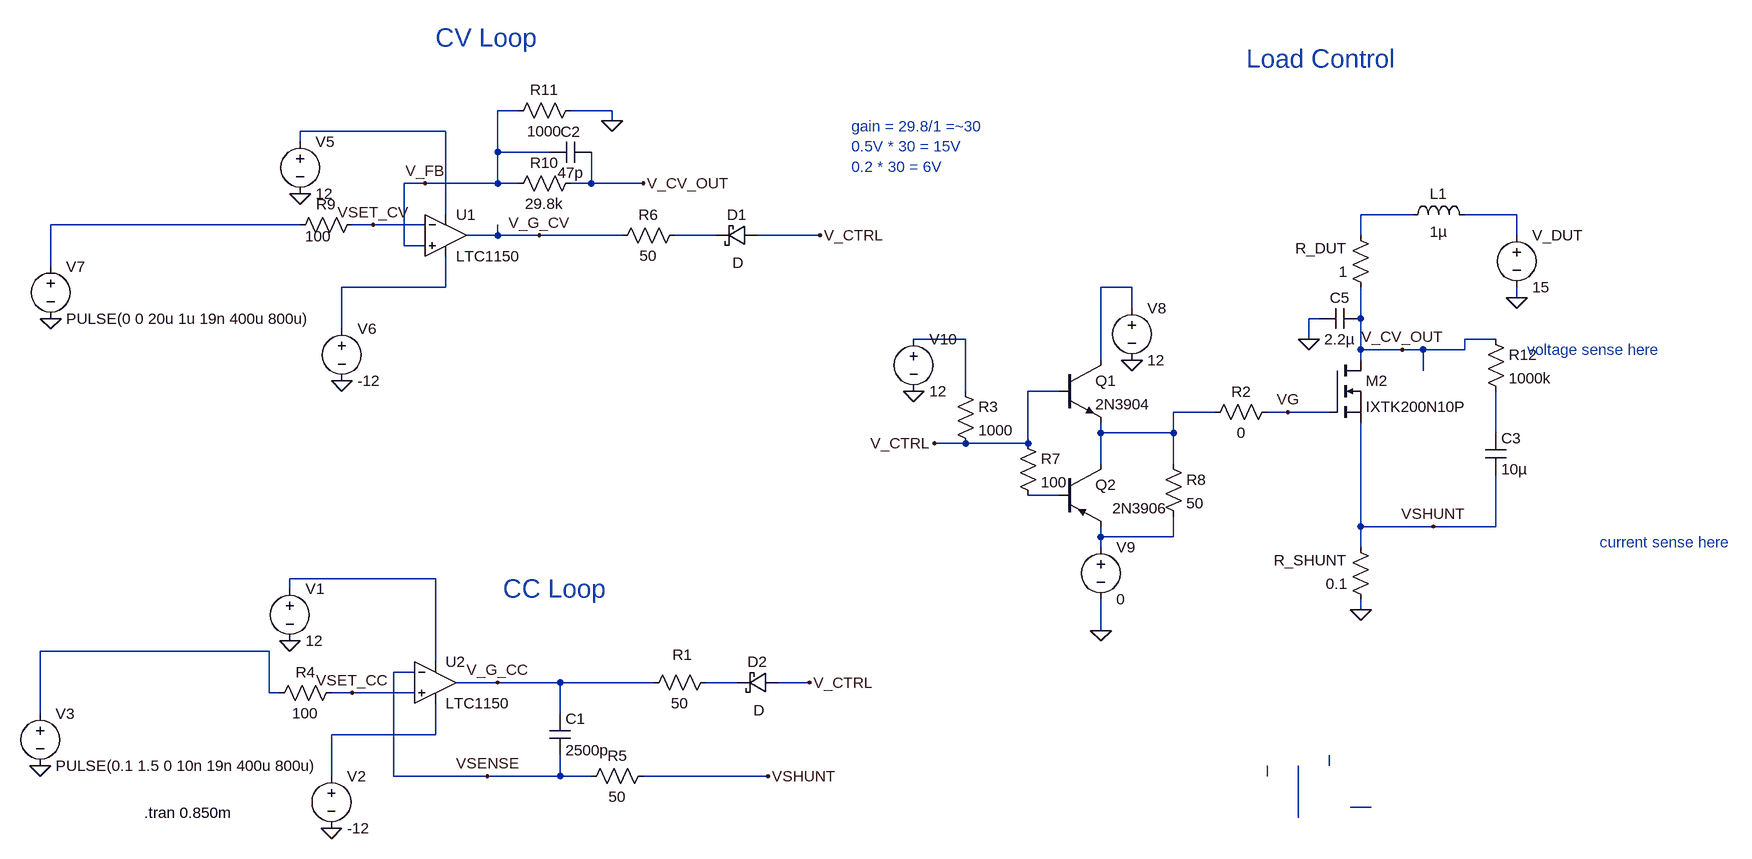
[diagram p0: schematic LeelaEload0p1.asc]
LeelaEload0p1.asc, the LTspice schematic file:
Version 4
SHEET 1 2156 680
WIRE 288 -688 256 -688
WIRE 432 -688 368 -688
WIRE 432 -672 432 -688
WIRE 176 -656 -48 -656
WIRE -48 -640 -48 -656
WIRE 256 -624 256 -688
WIRE 336 -624 256 -624
WIRE 144 -576 112 -576
WIRE 256 -576 256 -624
WIRE 256 -576 144 -576
WIRE 288 -576 256 -576
WIRE 400 -576 400 -624
WIRE 400 -576 368 -576
WIRE 480 -576 400 -576
WIRE 176 -528 176 -656
WIRE 1664 -528 1584 -528
WIRE 1824 -528 1744 -528
WIRE -48 -512 -432 -512
WIRE 64 -512 32 -512
WIRE 144 -512 64 -512
WIRE 256 -496 256 -512
WIRE 256 -496 208 -496
WIRE 320 -496 256 -496
WIRE 448 -496 320 -496
WIRE 592 -496 528 -496
WIRE 752 -496 656 -496
WIRE 1584 -496 1584 -528
WIRE 1824 -496 1824 -528
WIRE 112 -480 112 -576
WIRE 144 -480 112 -480
WIRE -432 -448 -432 -512
WIRE 176 -416 176 -464
WIRE 176 -416 16 -416
WIRE 1232 -416 1184 -416
WIRE 1824 -400 1824 -416
WIRE 1232 -384 1232 -416
WIRE 1520 -368 1504 -368
WIRE 1584 -368 1584 -416
WIRE 16 -352 16 -416
WIRE 976 -336 896 -336
WIRE 1504 -336 1504 -368
WIRE 1792 -336 1744 -336
WIRE 1584 -320 1584 -368
WIRE 1648 -320 1584 -320
WIRE 1680 -320 1648 -320
WIRE 1744 -320 1744 -336
WIRE 1744 -320 1680 -320
WIRE 1184 -304 1184 -416
WIRE 1584 -304 1584 -320
WIRE 1680 -288 1680 -320
WIRE 976 -256 976 -336
WIRE 1120 -256 1072 -256
WIRE 1360 -224 1296 -224
WIRE 1472 -224 1440 -224
WIRE 1536 -224 1472 -224
WIRE 1184 -192 1184 -208
WIRE 1296 -192 1296 -224
WIRE 1296 -192 1184 -192
WIRE 1792 -192 1792 -256
WIRE 976 -176 928 -176
WIRE 1072 -176 1072 -256
WIRE 1072 -176 976 -176
WIRE 1184 -144 1184 -192
WIRE 1296 -144 1296 -192
WIRE 1120 -96 1072 -96
WIRE 1584 -48 1584 -208
WIRE 1696 -48 1584 -48
WIRE 1792 -48 1792 -128
WIRE 1792 -48 1696 -48
WIRE 1184 -32 1184 -48
WIRE 1296 -32 1296 -64
WIRE 1296 -32 1184 -32
WIRE 1184 -16 1184 -32
WIRE 1584 -16 1584 -48
WIRE 160 32 -64 32
WIRE -64 48 -64 32
WIRE 1584 80 1584 64
WIRE 1184 112 1184 64
WIRE -96 144 -448 144
WIRE 160 160 160 32
WIRE 128 176 96 176
WIRE 256 192 192 192
WIRE 352 192 256 192
WIRE 496 192 352 192
WIRE 624 192 576 192
WIRE 736 192 688 192
WIRE -96 208 -96 144
WIRE -80 208 -96 208
WIRE 32 208 0 208
WIRE 128 208 32 208
WIRE -448 240 -448 144
WIRE 352 240 352 192
WIRE 160 272 160 224
WIRE 160 272 0 272
WIRE 1536 320 1536 304
WIRE 0 336 0 272
WIRE 96 336 96 176
WIRE 240 336 96 336
WIRE 352 336 352 304
WIRE 352 336 240 336
WIRE 400 336 352 336
WIRE 672 336 480 336
WIRE 1440 336 1440 320
WIRE 1600 384 1568 384
WIRE 1488 400 1488 320
FLAG 0 416 0
FLAG -448 320 0
FLAG -64 128 0
FLAG 32 208 VSET_CC
FLAG 240 336 VSENSE
FLAG 1824 -400 0
FLAG 16 -272 0
FLAG -432 -368 0
FLAG -48 -560 0
FLAG 1584 80 0
FLAG 64 -512 VSET_CV
FLAG 1472 -224 VG
FLAG 1696 -48 VSHUNT
FLAG 432 -672 0
FLAG 320 -496 V_G_CV
FLAG 144 -576 V_FB
FLAG 1648 -320 V_CV_OUT
FLAG 672 336 VSHUNT
FLAG 256 192 V_G_CC
FLAG 1184 112 0
FLAG 1232 -304 0
FLAG 928 -176 V_CTRL
FLAG 896 -256 0
FLAG 480 -576 V_CV_OUT
FLAG 736 192 V_CTRL
FLAG 752 -496 V_CTRL
FLAG 1504 -336 0
SYMBOL voltage -64 32 R0
WINDOW 123 0 0 Left 0
WINDOW 39 0 0 Left 0
SYMATTR InstName V1
SYMATTR Value 12
SYMBOL voltage 0 320 R0
WINDOW 123 0 0 Left 0
WINDOW 39 0 0 Left 0
SYMATTR InstName V2
SYMATTR Value -12
SYMBOL voltage -448 224 R0
WINDOW 123 0 0 Left 0
WINDOW 39 0 0 Left 0
SYMATTR InstName V3
SYMATTR Value PULSE(0.1 1.5 0 10n 19n 400u 800u)
SYMBOL res 592 176 R90
WINDOW 0 -11 52 VBottom 2
WINDOW 3 32 56 VTop 2
SYMATTR InstName R1
SYMATTR Value 50
SYMBOL res -96 224 R270
WINDOW 0 32 56 VTop 2
WINDOW 3 0 56 VBottom 2
SYMATTR InstName R4
SYMATTR Value 100
SYMBOL cap 336 240 R0
SYMATTR InstName C1
SYMATTR Value 2500p
SYMBOL res 496 320 R90
WINDOW 0 0 56 VBottom 2
WINDOW 3 32 56 VTop 2
SYMATTR InstName R5
SYMATTR Value 50
SYMBOL voltage -48 -656 R0
WINDOW 123 0 0 Left 0
WINDOW 39 0 0 Left 0
SYMATTR InstName V5
SYMATTR Value 12
SYMBOL voltage 16 -368 R0
WINDOW 123 0 0 Left 0
WINDOW 39 0 0 Left 0
SYMATTR InstName V6
SYMATTR Value -12
SYMBOL voltage -432 -464 R0
WINDOW 123 0 0 Left 0
WINDOW 39 0 0 Left 0
SYMATTR InstName V7
SYMATTR Value PULSE(0 0 20u 1u 19n 400u 800u)
SYMBOL voltage 1824 -512 R0
WINDOW 123 0 0 Left 0
WINDOW 39 0 0 Left 0
SYMATTR InstName V_DUT
SYMATTR Value 15
SYMBOL res 1600 80 R180
WINDOW 0 36 76 Left 2
WINDOW 3 36 40 Left 2
SYMATTR InstName R_SHUNT
SYMATTR Value 0.1
SYMBOL res 1600 -400 R180
WINDOW 0 36 76 Left 2
WINDOW 3 36 40 Left 2
SYMATTR InstName R_DUT
SYMATTR Value 1
SYMBOL res -64 -496 R270
WINDOW 0 32 56 VTop 2
WINDOW 3 14 44 VBottom 2
SYMATTR InstName R9
SYMATTR Value 100
SYMBOL res 384 -592 R90
WINDOW 0 0 56 VBottom 2
WINDOW 3 32 56 VTop 2
SYMATTR InstName R10
SYMATTR Value 29.8k
SYMBOL res 384 -704 R90
WINDOW 0 0 56 VBottom 2
WINDOW 3 32 56 VTop 2
SYMATTR InstName R11
SYMATTR Value 1000
SYMBOL nmos 1536 -304 R0
SYMATTR InstName M2
SYMATTR Value IXTK200N10P
SYMBOL Cap 400 -640 R90
WINDOW 0 0 32 VBottom 2
WINDOW 3 32 32 VTop 2
SYMATTR InstName C2
SYMATTR Value 47p
SYMBOL voltage 1232 -400 R0
WINDOW 123 0 0 Left 0
WINDOW 39 0 0 Left 0
SYMATTR InstName V8
SYMATTR Value 12
SYMBOL Res 1456 -240 R90
WINDOW 0 0 56 VBottom 2
WINDOW 3 32 56 VTop 2
SYMATTR InstName R2
SYMATTR Value 0
SYMBOL voltage 1184 -32 R0
WINDOW 123 0 0 Left 0
WINDOW 39 0 0 Left 0
SYMATTR InstName V9
SYMATTR Value 0
SYMBOL voltage 896 -352 R0
WINDOW 123 0 0 Left 0
WINDOW 39 0 0 Left 0
SYMATTR InstName V10
SYMATTR Value 12
SYMBOL schottky 688 176 R90
WINDOW 0 0 32 VBottom 2
WINDOW 3 43 30 VTop 2
SYMATTR InstName D2
SYMBOL Res 960 -272 R0
SYMATTR InstName R3
SYMATTR Value 1000
SYMBOL Res 544 -512 R90
WINDOW 0 0 56 VBottom 2
WINDOW 3 32 56 VTop 2
SYMATTR InstName R6
SYMATTR Value 50
SYMBOL schottky 656 -512 R90
WINDOW 0 0 32 VBottom 2
WINDOW 3 43 30 VTop 2
SYMATTR InstName D1
SYMBOL LTC1150 160 128 R0
SYMATTR InstName U2
SYMBOL LTC1150 176 -560 R0
SYMATTR InstName U1
SYMBOL npn 1120 -304 R0
SYMATTR InstName Q1
SYMATTR Value 2N3904
SYMBOL pnp 1120 -144 R0
WINDOW 3 82 68 Left 2
SYMATTR Value 2N3906
SYMATTR InstName Q2
SYMBOL Res 1056 -192 R0
SYMATTR InstName R7
SYMATTR Value 100
SYMBOL Res 1280 -160 R0
SYMATTR InstName R8
SYMATTR Value 50
SYMBOL ind 1648 -512 R270
WINDOW 0 32 56 VTop 2
WINDOW 3 5 56 VBottom 2
SYMATTR InstName L1
SYMATTR Value 1µ
SYMBOL Res 1776 -352 R0
SYMATTR InstName R12
SYMATTR Value 1000k
SYMBOL Cap 1776 -192 R0
SYMATTR InstName C3
SYMATTR Value 10µ
SYMBOL Cap 1584 -384 R90
WINDOW 0 0 32 VBottom 2
WINDOW 3 32 32 VTop 2
SYMATTR InstName C5
SYMATTR Value 2.2µ
TEXT -288 392 Left 2 !.tran 0.850m
TEXT 160 -800 Left 4 ;CV Loop
TEXT 264 48 Left 4 ;CC Loop
TEXT 1408 -768 Left 4 ;Load Control
TEXT 1952 -24 Left 2 ;current sense here
TEXT 1840 -320 Left 2 ;voltage sense here
TEXT 800 -664 Left 2 ;gain = 29.8/1 =~30\n0.5V * 30 = 15V\n0.2 * 30 = 6V

The netlist it stands for:
* LeelaEload0p1.asc
V1 N013 0 12
V2 N016 0 -12
V3 N014 0 PULSE(0.1 1.5 0 10n 19n 400u 800u)
R1 N015 V_G_CC 50
R4 N014 VSET_CC 100
C1 V_G_CC VSENSE 2500p
R5 VSHUNT VSENSE 50
V5 N001 0 12
V6 N006 0 -12
V7 N004 0 PULSE(0 0 20u 1u 19n 400u 800u)
V_DUT N003 0 15
R_SHUNT 0 VSHUNT 0.1
R_DUT V_CV_OUT N002 1
R9 N004 VSET_CV 100
R10 V_CV_OUT V_FB 29.8k
R11 0 V_FB 1000
M2 V_CV_OUT VG VSHUNT VSHUNT IXTK200N10P
C2 V_CV_OUT V_FB 47p
V8 N007 0 12
R2 VG N009 0
V9 N012 0 0
V10 N008 0 12
D2 V_CTRL N015 D
R3 N008 V_CTRL 1000
R6 N005 V_G_CV 50
D1 V_CTRL N005 D
XU2 VSET_CC VSENSE N013 N016 V_G_CC LTC1150  ; pins In+ In- V+ V- OUT
XU1 V_FB VSET_CV N001 N006 V_G_CV LTC1150  ; pins In+ In- V+ V- OUT
Q1 N007 V_CTRL N009 0 2N3904
Q2 N009 N011 N012 0 2N3906
R7 V_CTRL N011 100
R8 N009 N012 50
L1 N002 N003 1µ
R12 V_CV_OUT N010 1000k
C3 N010 VSHUNT 10µ
C5 V_CV_OUT 0 2.2µ
.model D D
.lib standard.dio
.model NPN NPN
.model PNP PNP
.lib standard.bjt
.model NMOS NMOS
.model PMOS PMOS
.lib standard.mos
.tran 0.850m
* CV Loop
* CC Loop
* Load Control
* current sense here
* voltage sense here
* gain = 29.8/1 =~30
* 0.5V * 30 = 15V
* 0.2 * 30 = 6V
.lib LTC.lib
.backanno
.end